# Altium schematic sheet CC2541A.SchDoc: CC2541A
size 431 x 279 mm; Date: Not shown in title block; ApprovedBy: Not shown in title block; CheckedBy: Not shown in title block; Author: Not shown in title block; CompanyName: Not shown in title block; DrawnBy: Ajinder Singh; Engineer: Not shown in title block; Organization: Not shown in title block; Address1: Not shown in title block; Address2: Not shown in title block; Address3: Not shown in title block; Address4: Not shown in title block; DocumentNumber: 1; Revision: Use project parameter SCH_Rev; SheetNumber: 1; SheetTotal: 1; PageSetup: Record=PageOptions|CenterHorizontal=True|CenterVertical=True|PrintScale=0.95|XCorrection=1.00|YCorrection=1.00|PrintKind=0|BorderSize=5000000|LeftOffset=0|BottomOffset=0|Orientation=2|PaperLength=1000|PaperWidth=1000|Scale=100|PaperSource=15|PrintQuality=600|MediaType=1|DitherType=10|PrintScaleMode=1|PaperKind=11x17; CurrentTime: Not shown in title block; CurrentDate: Not shown in title block; Time: Not shown in title block; DocumentFullPathAndName: Not shown in title block; DocumentName: Not shown in title block; ModifiedDate: Not shown in title block; ImagePath: Not shown in title block
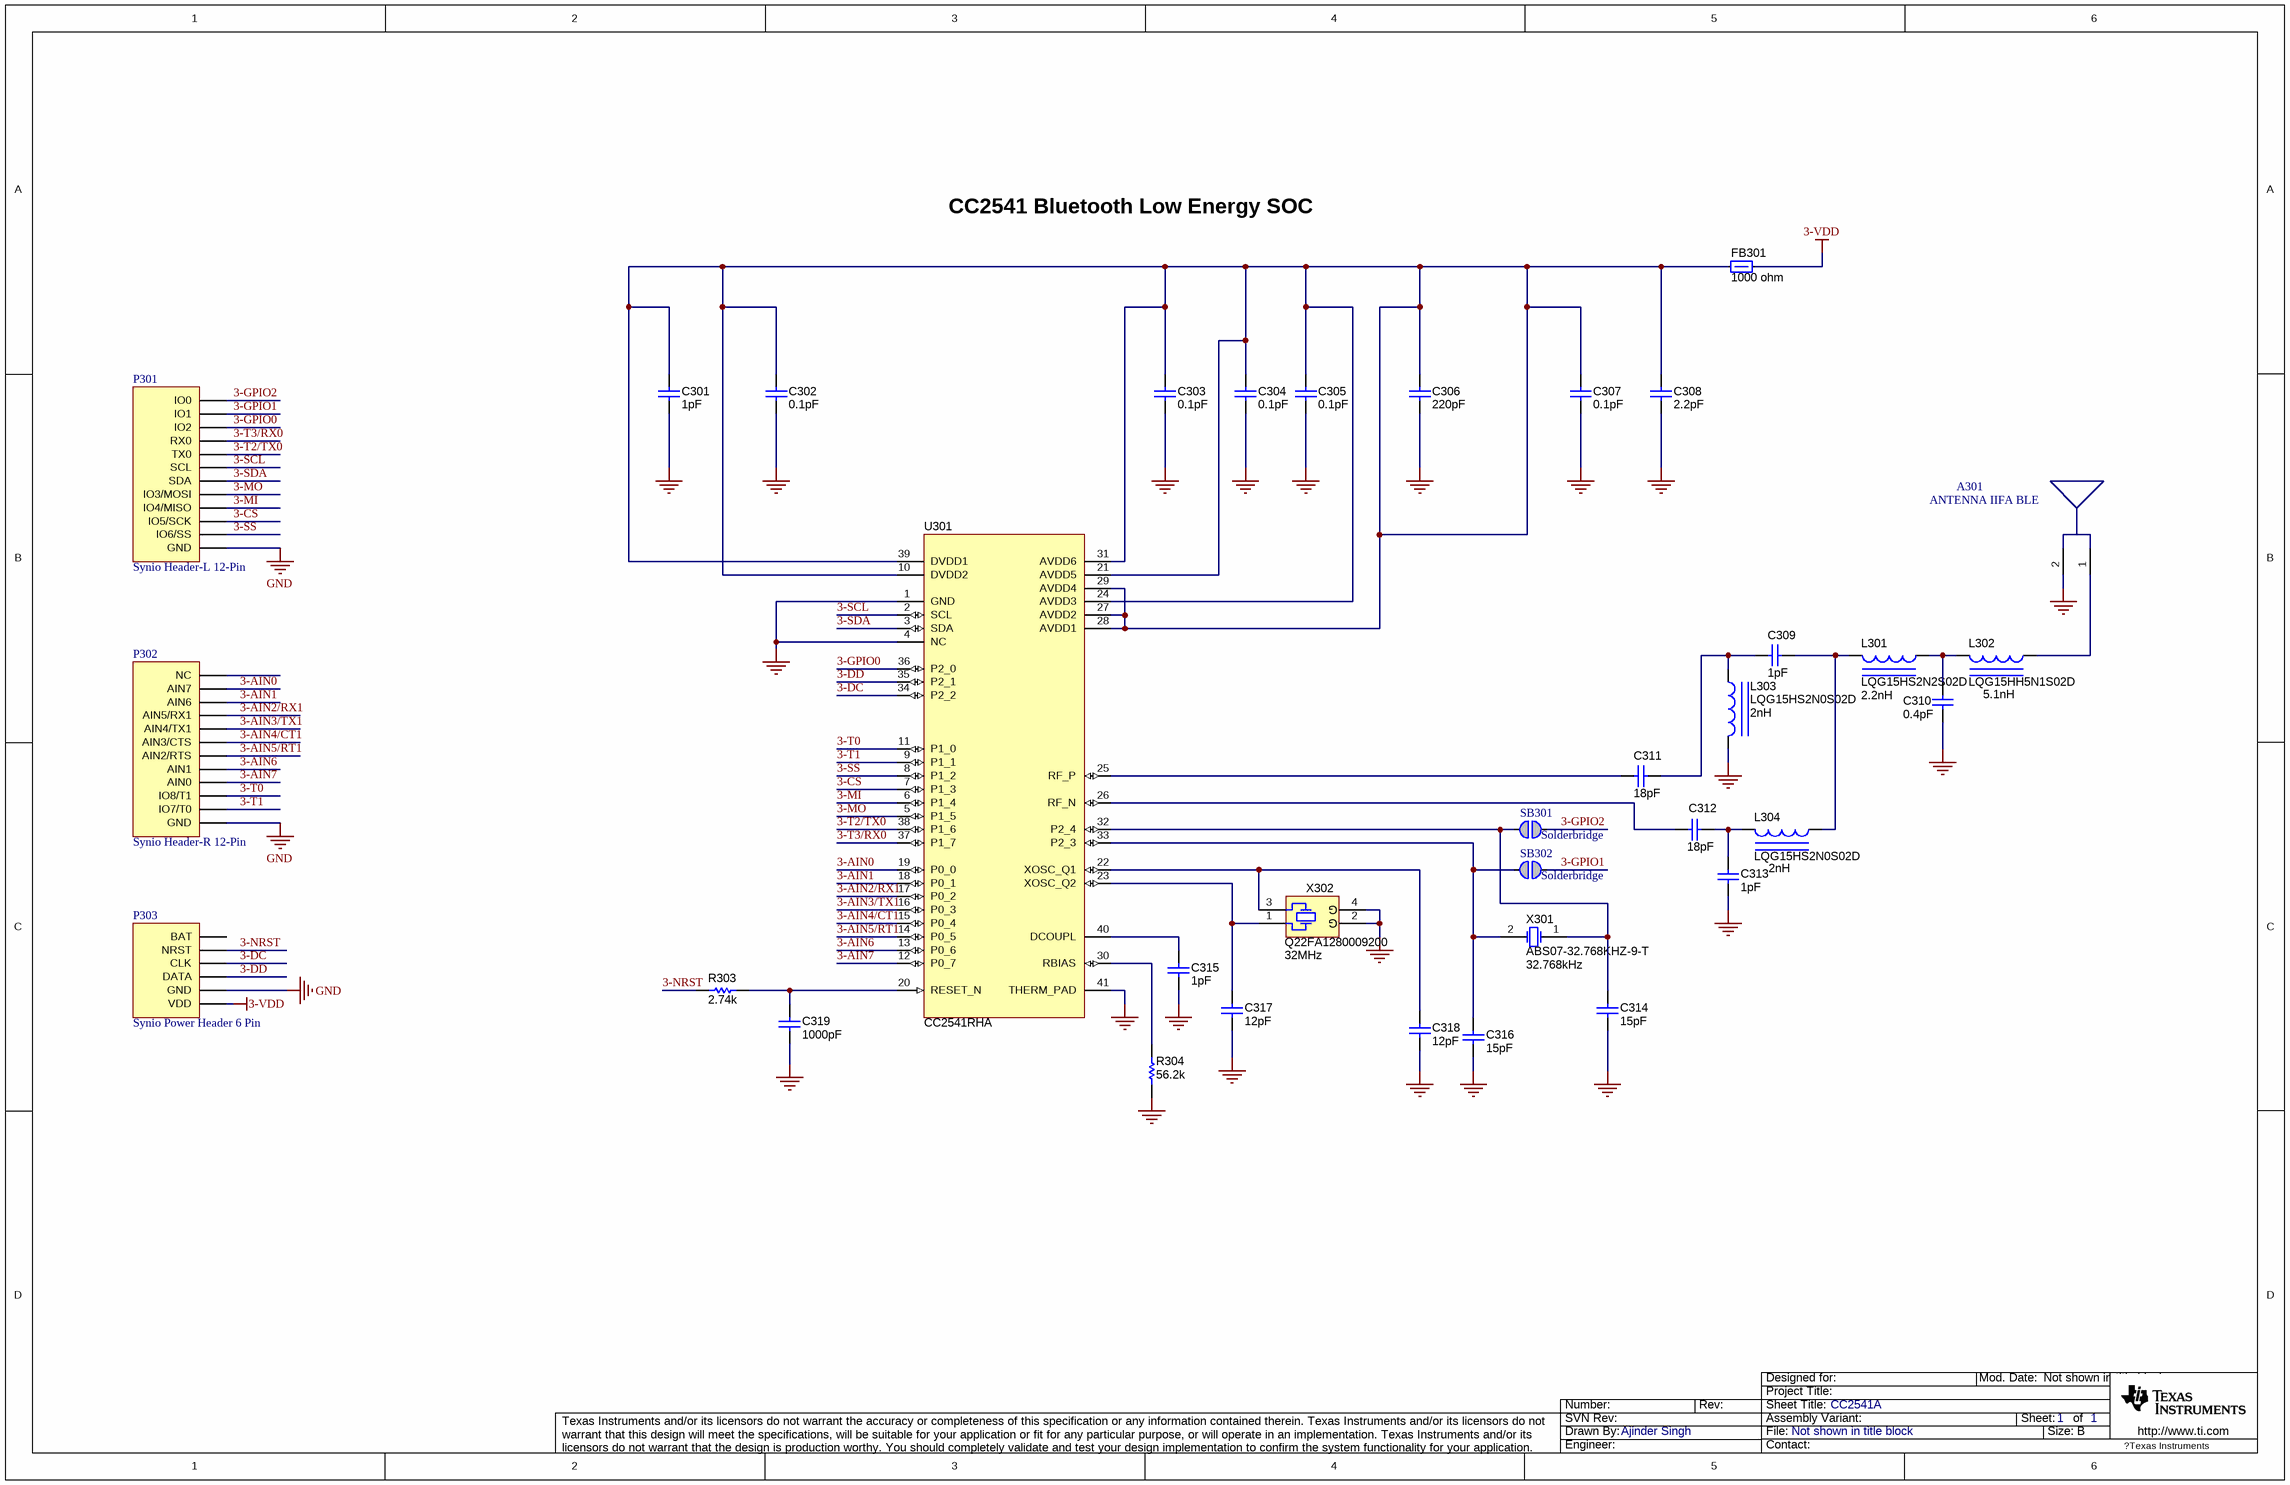
[diagram p0: CC2541A.SchDoc]

## Parts
A301  ANTENNA IIFA BLE  [Antenna_IIFA_BLE-2]  (net tie, no BOM)
C301  ValueDisplayed: 1pF  [0402L]  (hidden comment: C1005X5R0J105M)
C302  ValueDisplayed: 0.1pF  [0402L]  (hidden comment: GRM155R71A104KA01D)
C303  ValueDisplayed: 0.1pF  [0402L]  (hidden comment: GRM155R71A104KA01D)
C304  ValueDisplayed: 0.1pF  [0402L]  (hidden comment: GRM155R71A104KA01D)
C305  ValueDisplayed: 0.1pF  [0402L]  (hidden comment: GRM155R71A104KA01D)
C306  ValueDisplayed: 220pF  [0402L]  (hidden comment: GRM1555C1H221JA01D)
C307  ValueDisplayed: 0.1pF  [0402L]  (hidden comment: GRM155R71A104KA01D)
C308  ValueDisplayed: 2.2pF  [0402L]  (hidden comment: JMK105BJ225MV-F)
C309  ValueDisplayed: 1pF  [0402L]  (hidden comment: GRM1555C1H1R0CA01D)
C310  ValueDisplayed: 0.4pF  [0402L]  (hidden comment: GRM1555C1HR40BA01D)
C311  ValueDisplayed: 18pF  [0402L]  (hidden comment: GRM1555C1H180JA01D)
C312  ValueDisplayed: 18pF  [0402L]  (hidden comment: GRM1555C1H180JA01D)
C313  ValueDisplayed: 1pF  [0402L]  (hidden comment: GRM1555C1H1R0CA01D)
C314  ValueDisplayed: 15pF  [0402L]  (hidden comment: GRM1555C1H150JA01D)
C315  ValueDisplayed: 1pF  [0402L]  (hidden comment: C1005X5R0J105M)
C316  ValueDisplayed: 15pF  [0402L]  (hidden comment: GRM1555C1H150JA01D)
C317  ValueDisplayed: 12pF  [0402L]  (hidden comment: GRM1555C1H120JA01D)
C318  ValueDisplayed: 12pF  [0402L]  (hidden comment: GRM1555C1H120JA01D)
C319  ValueDisplayed: 1000pF  [0402L]  (hidden comment: GRM1555C1H102JA01D)
FB301  value 1000 ohm  [0402]  (hidden comment: BLM15HG102SN1D)
L301  LQG15HS2N2S02D  ValueDisplayed: 2.2nH  [IND_LQG15H]
L302  LQG15HH5N1S02D  ValueDisplayed: 5.1nH  [0402L]
L303  LQG15HS2N0S02D  ValueDisplayed: 2nH  [0402L]
L304  LQG15HS2N0S02D  ValueDisplayed: 2nH  [0402L]
P301  Synio Header-L 12-Pin  [HDR1X12]
P302  Synio Header-R 12-Pin  [HDR1X12]
P303  Synio Power Header 6 Pin  [HDR1X6/2.54MM]
R303  value 2.74k  [0402L]  (hidden comment: CRCW04022K74FKED)
R304  value 56.2k  [0402L]  (hidden comment: CRCW040256K2FKED)
SB301  Solderbridge  [JP2_SMD]  (no BOM)
SB302  Solderbridge  [JP2_SMD]  (no BOM)
U301  CC2541RHA  [RHA0040H]
X301  ABS07-32.768KHZ-9-T  Frequency: 32.768kHz  [XTAL_ABS07]
X302  Q22FA1280009200  Frequency: 32MHz  [XTAL_FA-128]

## Nets
3-VDD: FB301.2 P303.1(VDD)
GND: A301.2 C301.2 C302.2 C303.2 C304.2 C305.2 C306.2 C307.2 C308.2 C310.2 C313.2 C314.2 C315.2 C316.2 C317.2 C318.2 C319.2 L303.2 P301.1(GND) P302.1(GND) P303.2(GND) R304.1 U301.1(GND) U301.4(NC) U301.41(THERM_PAD) X302.2(GND) X302.4(GND)
3-AIN0: P302.11(AIN7) U301.19(P0_0)
3-AIN1: P302.10(AIN6) U301.18(P0_1)
3-AIN2/RX1: P302.9(AIN5/RX1) U301.17(P0_2)
3-AIN3/TX1: P302.8(AIN4/TX1) U301.16(P0_3)
3-AIN4/CT1: P302.7(AIN3/CTS) U301.15(P0_4)
3-AIN5/RT1: P302.6(AIN2/RTS) U301.14(P0_5)
3-AIN6: P302.5(AIN1) U301.13(P0_6)
3-AIN7: P302.4(AIN0) U301.12(P0_7)
3-CS: P301.3(IO5/SCK) U301.7(P1_3)
3-DC: P303.4(CLK) U301.34(P2_2)
3-DD: P303.3(DATA) U301.35(P2_1)
3-GPIO0: P301.10(IO2) U301.36(P2_0)
3-GPIO1: P301.11(IO1) SB302.1
3-GPIO2: P301.12(IO0) SB301.1
3-MI: P301.4(IO4/MISO) U301.6(P1_4)
3-MO: P301.5(IO3/MOSI) U301.5(P1_5)
3-NRST: P303.5(NRST) R303.1
3-SCL: P301.7(SCL) U301.2(SCL)
3-SDA: P301.6(SDA) U301.3(SDA)
3-SS: P301.2(IO6/SS) U301.8(P1_2)
3-T0: P302.3(IO8/T1) U301.11(P1_0)
3-T1: P302.2(IO7/T0) U301.9(P1_1)
3-T2/TX0: P301.8(TX0) U301.38(P1_6)
3-T3/RX0: P301.9(RX0) U301.37(P1_7)
NetA301_1: A301.1 L302.1
NetC301_1: C301.1 C302.1 C303.1 C304.1 C305.1 C306.1 C307.1 C308.1 FB301.1 U301.10(DVDD2) U301.21(AVDD5) U301.24(AVDD3) U301.27(AVDD2) U301.28(AVDD1) U301.29(AVDD4) U301.31(AVDD6) U301.39(DVDD1)
NetC309_1: C309.1 C311.1 L303.1
NetC309_2: C309.2 L301.2 L304.1
NetC310_1: C310.1 L301.1 L302.2
NetC311_2: C311.2 U301.25(RF_P)
NetC312_1: C312.1 C313.1 L304.2
NetC312_2: C312.2 U301.26(RF_N)
NetC314_1: C314.1 SB301.2 U301.32(P2_4) X301.1(OSC1)
NetC315_1: C315.1 U301.40(DCOUPL)
NetC316_1: C316.1 SB302.2 U301.33(P2_3) X301.2(OSC2)
NetC317_1: C317.1 U301.23(XOSC_Q2) X302.1
NetC318_1: C318.1 U301.22(XOSC_Q1) X302.3
NetC319_1: C319.1 R303.2 U301.20(RESET_N)
NetR304_2: R304.2 U301.30(RBIAS)

Not connected (* = marked no-connect by the designer): P302 12(NC); P303 6(BAT)

## Notes on the sheet
- CC2541 Bluetooth Low Energy SOC
- Drawn By:
- SVN Rev:
- Number:
- Rev:
- Sheet Title:
- File:
- Project Title:
- Designed for:
- Assembly Variant:
- Mod. Date:
- Sheet:
- Size:
- of
- B
- http://www.ti.com
- Texas Instruments and/or its licensors do not warrant the accuracy or completeness of this specification or any information contained therein. Texas Instruments and/or its licensors do not warrant that this design will meet the specifications, will be suitable for your application or fit for any particular purpose, or will operate in an implementation. Texas Instruments and/or its licensors do not warrant that the design is production worthy. You should completely validate and test your design implementation to confirm the system functionality for your application.
- Engineer:
- Contact:
- ?Texas Instruments
- (in symbol Q22FA1280009200) G

## Library data of the parts
A301 = Antenna: ASSY_OPTION: NO PART TO ORDER OR PLACE AT ASSY
C301 C315 = C1005X5R0J105M: CAP, CERM, 1uF, 6.3V, +/-20%, X5R, 0402; Manufacturer: TDK; Polarized: N; CompType: Capacitor; U/M: EA; Cap_F: 0.000001; Tolerance_%: 20; ESR_Ohm: 0.0079; Value1: 0.0079 ohm; VDC_V: 6.3; TaMin_C: -55; TaMax_C: 85; Cap_Case: 0402; SymbolVersion: 2008-07-09; Value: 1uF; PartNumber: C1005X5R0J105M; PackageReference: 0402; RoHS: Y; Value2: 6.3V; MountType: SMT; Technology: Ceramic; TempCo: X5R; Published: 2008-06-19; Publisher: Texas Instruments; LatestRevisionDate: 2013-04-08; LatestRevisionNote: Changed publisher; ComponentLink1Description: Datasheet link; ComponentLink1URL: http://www.tdk.co.jp/tefe02/e412_c.pdf; Supplier 1: Digi-Key; Supplier Part Number 1: 445-1415-1-ND; Supplier 2: Farnell; Supplier Part Number 2: 1844107
C302-C305 C307 = GRM155R71A104KA01D: CAP, CERM, 0.1uF, 10V, +/-10%, X7R, 0402; Manufacturer: MuRata; Polarized: N; CompType: Capacitor; U/M: EA; Cap_F: 0.0000001; Tolerance_%: 10; Value1: Unknown; TaMin_C: -55; TaMax_C: 125; Cap_Case: 0402; SymbolVersion: 2008-07-09; Value: 0.1uF; PartNumber: GRM155R71A104KA01D; PackageReference: 0402; RoHS: Y; VDC_V: 10; Value2: 10V; MountType: SMT; Technology: Ceramic; TempCo: X7R; Published: 2008-06-19; Publisher: Texas Instruments; LatestRevisionDate: 2013-04-08; LatestRevisionNote: Changed publisher; ComponentLink1Description: Datasheet link; ComponentLink1URL: http://search.murata.co.jp/Ceramy/PnsearchViewAction.do?HnOFG=ON&HnNFG=ON&SEL_CNT=50&sLang=en&sKey=GRM155R71A104KA01D&x=9&y=9&search=startwith; Supplier 1: Digi-Key; Supplier Part Number 1: GRM155R71A104KA01D-ND; Supplier 2: Mouser; Supplier Part Number 2: 81-GRM155R71A104KA1D; Supplier 3: Farnell; Supplier Part Number 3: 1828860
C306 = GRM1555C1H221JA01D: CAP, CERM, 220pF, 50V, +/-5%, C0G/NP0, 0402; Manufacturer: MuRata; Polarized: N; CompType: Capacitor; U/M: EA; Cap_F: 0.00000000022; Tolerance_%: 5; Value1: Unknown; VDC_V: 50; TaMin_C: -55; TaMax_C: 125; Cap_Case: 0402; SymbolVersion: 2008-07-09; Value: 220pF; PartNumber: GRM1555C1H221JA01D; PackageReference: 0402; RoHS: Y; Value2: 50V; MountType: SMT; Technology: Ceramic; TempCo: C0G/NP0; Published: 2008-06-19; Publisher: Texas Instruments; LatestRevisionDate: 2013-04-08; LatestRevisionNote: Changed publisher; ComponentLink1Description: Datasheet link; ComponentLink1URL: http://search.murata.co.jp/Ceramy/PnsearchViewAction.do?HnOFG=ON&HnNFG=ON&SEL_CNT=50&sLang=en&sKey=GRM1555C1H221JA01D&x=9&y=9&search=startwith; Supplier 1: Digi-Key; Supplier Part Number 1: 490-1293-1-ND; Supplier 2: Mouser; Supplier Part Number 2: 81-GRM1555C1H221JA01; Supplier 3: Farnell; Supplier Part Number 3: 8819580
C308 = JMK105BJ225MV-F: CAP, CERM, 2.2uF, 6.3V, +/-20%, X5R, 0402; Manufacturer: Taiyo Yuden; Polarized: N; CompType: Capacitor; U/M: EA; Cap_F: 0.0000022; Tolerance_%: 20; ESR_Ohm: 0.00152; Value1: 0.00152 ohm; VDC_V: 6.3; TaMin_C: -55; TaMax_C: 125; Cap_Case: 0402; SymbolVersion: 2008-07-09; Value: 2.2uF; PartNumber: JMK105BJ225MV-F; PackageReference: 0402; RoHS: Y; Value2: 6.3V; MountType: SMT; Technology: Ceramic; TempCo: X5R; Published: 2008-06-19; Publisher: Texas Instruments; LatestRevisionDate: 2013-04-08; LatestRevisionNote: Changed publisher; ComponentLink1Description: Datasheet link; ComponentLink1URL: http://www.yuden.co.jp/productdata/catalog/en/mlcc01_e.pdf; Supplier 1: Farnell; Supplier Part Number 1: 1833802
C309 C313 = GRM1555C1H1R0CA01D: CAP, CERM, 1pF, 50V, +/-5%, C0G/NP0, 0402; Manufacturer: MuRata; Polarized: N; CompType: Capacitor; U/M: EA; Cap_F: 0.000000000001; Tolerance_%: 5; Value1: Unknown; VDC_V: 50; TaMin_C: -55; TaMax_C: 125; Cap_Case: 0402; SymbolVersion: 2008-07-09; Value: 1pF; PartNumber: GRM1555C1H1R0CA01D; PackageReference: 0402; RoHS: Y; Value2: 50V; MountType: SMT; Technology: Ceramic; TempCo: C0G/NP0; Published: 2008-06-19; Publisher: Texas Instruments; LatestRevisionDate: 2013-04-08; LatestRevisionNote: Changed publisher; ComponentLink1Description: Datasheet link; ComponentLink1URL: http://search.murata.co.jp/Ceramy/image/img/PDF/ENG/GRM1555C1H1R0CA01.pdf; Supplier 1: Digi-Key; Supplier Part Number 1: 490-3199-1-ND; Supplier 2: Mouser; Supplier Part Number 2: 81-GRM1555C1H1R0CA1D
C310 = GRM1555C1HR40BA01D: CAP, CERM, 0.4pF, 50V, +/-25%, C0G/NP0, 0402; Manufacturer: MuRata; Polarized: N; CompType: Capacitor; U/M: EA; Cap_F: 0.0000000000004; Tolerance_%: 25; Value1: Unknown; VDC_V: 50; TaMin_C: -55; TaMax_C: 125; Cap_Case: 0402; SymbolVersion: 2008-07-09; Value: 0.4pF; PartNumber: GRM1555C1HR40BA01D; PackageReference: 0402; RoHS: Y; Value2: 50V; MountType: SMT; Technology: Ceramic; TempCo: C0G/NP0; Published: 2008-06-19; Publisher: Texas Instruments; LatestRevisionDate: 2013-06-21; ComponentLink1Description: Datasheet link; ComponentLink1URL: http://www.murata.com/products/catalog/pdf/c02e.pdf; Supplier 1: Digi-Key; Supplier Part Number 1: GRM1555C1HR40BA01D-ND; Supplier 2: Mouser; Supplier Part Number 2: 81-GRM1555C1HR40BA1D
C311 C312 = GRM1555C1H180JA01D: CAP, CERM, 18pF, 50V, +/-5%, C0G/NP0, 0402; Manufacturer: MuRata; Polarized: N; CompType: Capacitor; U/M: EA; Cap_F: 0.000000000018; Tolerance_%: 5; Value1: Unknown; VDC_V: 50; TaMin_C: -55; TaMax_C: 125; Cap_Case: 0402; SymbolVersion: 2008-07-09; Value: 18pF; PartNumber: GRM1555C1H180JA01D; PackageReference: 0402; RoHS: Y; Value2: 50V; MountType: SMT; Technology: Ceramic; TempCo: C0G/NP0; Published: 2008-06-19; Publisher: Texas Instruments; LatestRevisionDate: 2013-04-08; LatestRevisionNote: Changed publisher; ComponentLink1Description: Datasheet link; ComponentLink1URL: http://search.murata.co.jp/Ceramy/PnsearchViewAction.do?HnOFG=ON&HnNFG=ON&SEL_CNT=50&sLang=en&sKey=GRM1555C1H180JA01D&x=9&y=9&search=startwith; Supplier 1: Mouser; Supplier Part Number 1: 81-GRM1555C1H180JA1D; Supplier 2: Farnell; Supplier Part Number 2: 1828876; Supplier 3: Newark; Supplier Part Number 3: 14T3293
C314 C316 = GRM1555C1H150JA01D: CAP, CERM, 15pF, 50V, +/-5%, C0G/NP0, 0402; Manufacturer: MuRata; Polarized: N; CompType: Capacitor; U/M: EA; Cap_F: 0.000000000015; Tolerance_%: 5; Value1: Unknown; VDC_V: 50; TaMin_C: -55; TaMax_C: 125; Cap_Case: 0402; SymbolVersion: 2008-07-09; Value: 15pF; PartNumber: GRM1555C1H150JA01D; PackageReference: 0402; RoHS: Y; Value2: 50V; MountType: SMT; Technology: Ceramic; TempCo: C0G/NP0; Published: 2008-06-19; Publisher: Texas Instruments; LatestRevisionDate: 2013-04-08; LatestRevisionNote: Changed publisher; ComponentLink1Description: Datasheet link; ComponentLink1URL: http://search.murata.co.jp/Ceramy/PnsearchViewAction.do?HnOFG=ON&HnNFG=ON&SEL_CNT=50&sLang=en&sKey=GRM1555C1H150JA01D&x=9&y=9&search=startwith; Supplier 1: Mouser; Supplier Part Number 1: 81-GRM1555C1H150JA1D
C317 C318 = GRM1555C1H120JA01D: CAP, CERM, 12pF, 50V, +/-5%, C0G/NP0, 0402; Manufacturer: MuRata; Polarized: N; CompType: Capacitor; U/M: EA; Cap_F: 0.000000000012; Tolerance_%: 5; Value1: Unknown; VDC_V: 50; TaMin_C: -55; TaMax_C: 125; Cap_Case: 0402; SymbolVersion: 2008-07-09; Value: 12pF; PartNumber: GRM1555C1H120JA01D; PackageReference: 0402; RoHS: Y; Value2: 50V; MountType: SMT; Technology: Ceramic; TempCo: C0G/NP0; Published: 2008-06-19; Publisher: Texas Instruments; LatestRevisionDate: 2013-04-08; LatestRevisionNote: Changed publisher; ComponentLink1Description: Datasheet link; ComponentLink1URL: http://search.murata.co.jp/Ceramy/PnsearchViewAction.do?HnOFG=ON&HnNFG=ON&SEL_CNT=50&sLang=en&sKey=GRM1555C1H120JA01D&x=9&y=9&search=startwith; Supplier 1: Mouser; Supplier Part Number 1: 81-GRM1555C1H120JA1D; Supplier 2: Farnell; Supplier Part Number 2: 1828875; Supplier 3: Newark; Supplier Part Number 3: 14T3292
C319 = GRM1555C1H102JA01D: CAP, CERM, 1000pF, 50V, +/-5%, C0G/NP0, 0402; Manufacturer: MuRata; Polarized: N; CompType: Capacitor; U/M: EA; Cap_F: 0.000000001; Tolerance_%: 5; Value1: Unknown; VDC_V: 50; TaMin_C: -55; TaMax_C: 125; Cap_Case: 0402; SymbolVersion: 2008-07-09; Value: 1000pF; PartNumber: GRM1555C1H102JA01D; PackageReference: 0402; RoHS: Y; Value2: 50V; MountType: SMT; Technology: Ceramic; TempCo: C0G/NP0; Published: 2008-06-19; Publisher: Texas Instruments; LatestRevisionDate: 2013-04-08; LatestRevisionNote: Changed publisher; ComponentLink1Description: Datasheet link; ComponentLink1URL: http://search.murata.co.jp/Ceramy/PnsearchViewAction.do?HnOFG=ON&HnNFG=ON&SEL_CNT=50&sLang=en&sKey=GRM1555C1H102JA01D&x=9&y=9&search=startwith; Supplier 1: Digi-Key; Supplier Part Number 1: 490-3244-1-ND; Supplier 2: Mouser; Supplier Part Number 2: 81-GRM1555C1H102JA1D; Supplier 3: Farnell; Supplier Part Number 3: 8819556
FB301 = BLM15HG102SN1D: 0.25A Ferrite Bead, 1000 ohm @ 100MHz, SMD; Manufacturer: MuRata; Imax_A: 0.25; Irms: 0.25A @ C rise; Isat: 0.25A @ % inductance drop; DCR_ohm: 1.1; Value1: 1.1 ohm; ZTyp@100MHz_Ohm: 1000; U/M: EA; CompType: Ferrite Bead; SymbolVersion: 2009-06-02; PartNumber: BLM15HG102SN1D; PackageReference: 0402; Value2: 0.25A; Technology: Multilayer; MountType: SMT; Material: Ferrite; Published: 2008-06-26; Publisher: Texas Instruments; LatestRevisionDate: 2013-06-20; ComponentLink1Description: Datasheet link; ComponentLink1URL: http://search.murata.co.jp/Ceramy/image/img/PDF/ENG/L0110S0101BLM15H.pdf; RoHS: Y; Supplier 1: Digi-Key; Supplier Part Number 1: 490-3999-1-ND; Supplier 2: Mouser; Supplier Part Number 2: 81-BLM15HG102SN1D; Supplier 3: Farnell; Supplier Part Number 3: 1515788
L301 = LQG15HS2N2S02D: Inductor, Multilayer, Air Core, 2.2nH, 0.3A, 0.12 ohm, SMD; Manufacturer: MuRata; Ind_H: 2.2E-9; Imax_A: 0.3; Irms: 0.3A @ C rise; Isat: 0.3A @ % inductance drop; DCR_ohm: 0.12; U/M: EA; SymbolVersion: 2008-07-23; CompType: Inductor; Value: 2.2nH; PartNumber: LQG15HS2N2S02D; PackageReference: 0402 polarized; Value1: 0.12 ohm; Value2: 0.3A; Technology: Multilayer; MountType: SMT; Material: Air Core; Published: 2008-06-26; Publisher: Texas Instruments; LatestRevisionDate: 2013-06-24; ComponentLink1Description: Datasheet link; ComponentLink1URL: http://search.murata.co.jp/Ceramy/image/img/PDF/ENG/L0075S0083LQG15HS.pdf; RoHS: Y; Supplier 1: Digi-Key; Supplier Part Number 1: 490-2614-1-ND; Supplier 2: Mouser; Supplier Part Number 2: 81-LQG15HS2N2S02D
L302 = LQG15HH5N1S02D: Inductor, Multilayer, Ferrite, 5.1nH, 0.3A, 0.2 ohm, SMD; Manufacturer: MuRata; Ind_H: 5.1E-9; Imax_A: 0.3; Irms: 0.3A @ C rise; DCR_ohm: 0.2; Value1: 0.2 ohm; U/M: EA; SymbolVersion: 2008-07-23; CompType: Inductor; Value: 5.1nH; PartNumber: LQG15HH5N1S02D; PackageReference: 0402; Value2: 0.3A; Technology: Multilayer; MountType: SMT; Material: Ferrite; Published: 2008-06-26; Publisher: Texas Instruments; LatestRevisionDate: 2013-06-20; ComponentLink1Description: Datasheet link; ComponentLink1URL: http://www.murata.com/products/catalog/pdf/o05e.pdf; RoHS: Y; Supplier 1: Mouser; Supplier Part Number 1: 81-LQG15HH5N1S02D
L303 L304 = LQG15HS2N0S02D: Inductor, Multilayer, Ferrite, 2nH, 0.3A, 0.1 ohm, SMD; Manufacturer: MuRata; Ind_H: 2.0E-9; Imax_A: 0.3; Irms: 0.3A @ C rise; Isat: 0.3A @ % inductance drop; DCR_ohm: 0.1; Value1: 0.1 ohm; U/M: EA; SymbolVersion: 2008-07-23; CompType: Inductor; Value: 2nH; PartNumber: LQG15HS2N0S02D; PackageReference: 0402; Value2: 0.3A; Technology: Multilayer; MountType: SMT; Material: Ferrite; Published: 2008-06-26; Publisher: Texas Instruments; LatestRevisionDate: 2013-06-20; ComponentLink1Description: Datasheet link; ComponentLink1URL: http://search.murata.co.jp/Ceramy/image/img/PDF/ENG/L0075S0083LQG15HS.pdf; RoHS: Y; Supplier 1: Digi-Key; Supplier Part Number 1: 490-6569-1-ND; Supplier 2: Mouser; Supplier Part Number 2: 81-LQG15HS2N0S02D
P301 = Synio Header-L 12-Pin: Synio Header-L, 12-Pin; LatestRevisionDate: 17-Jul-2002; LatestRevisionNote: Re-released for DXP Platform.; Publisher: Altium Limited
P302 = Synio Header-R 12-Pin: Synio Header-R, 12-Pin; LatestRevisionDate: 17-Jul-2002; LatestRevisionNote: Re-released for DXP Platform.; Publisher: Altium Limited
R303 = CRCW04022K74FKED: RES, 2.74k ohm, 1%, 0.063W, 0402; Manufacturer: Vishay-Dale; CompType: Resistor; Res_ohm: 2740; Value_Code: 2k74; Tolerance_%: 1; Power_W: 0.063; VDC_V: 50; TempCo: 100 ppm/C; EIA_Code: E96; U/M: EA; SymbolVersion: 2009-05-29; PartNumber: CRCW04022K74FKED; PackageReference: 0402; RoHS: Y; Value1: 1%; Value2: 0.063W; MountType: SMT; Technology: Thick Film; Published: 2008-06-26; Publisher: Texas Instruments; LatestRevisionDate: 2013-01-08; ComponentLink1Description: Datasheet link; ComponentLink1URL: http://www.vishay.com/docs/20035/dcrcwe3.pdf; Supplier 1: Digi-Key; Supplier Part Number 1: 541-2.74KLCT-ND; Supplier 2: Mouser; Supplier Part Number 2: 71-CRCW0402-2.74K-E3; Supplier 3: Farnell; Supplier Part Number 3: 1469692
R304 = CRCW040256K2FKED: RES, 56.2k ohm, 1%, 0.063W, 0402; Manufacturer: Vishay-Dale; CompType: Resistor; Res_ohm: 56200; Value_Code: 56k2; Tolerance_%: 1; Power_W: 0.063; VDC_V: 50; TempCo: 100 ppm/C; EIA_Code: E96; U/M: EA; SymbolVersion: 2009-05-29; PartNumber: CRCW040256K2FKED; PackageReference: 0402; RoHS: Y; Value1: 1%; Value2: 0.063W; MountType: SMT; Technology: Thick Film; Published: 2008-06-26; Publisher: Texas Instruments; LatestRevisionDate: 2013-01-08; ComponentLink1Description: Datasheet link; ComponentLink1URL: http://www.vishay.com/docs/20035/dcrcwe3.pdf; Supplier 1: Digi-Key; Supplier Part Number 1: 541-56.2KLCT-ND; Supplier 2: Mouser; Supplier Part Number 2: 71-CRCW0402-56.2K-E3; Supplier 3: Farnell; Supplier Part Number 3: 1652808
SB301 SB302 = Solderbridge: Artikkelnr Noca: N.A.; Part Number: Solderbridge; Manufacturer: *; Manufacturer Part Number: *; Datasheet: *; Footprint: Solderbridge; LatestRevisionDate: 2009-12-14; Pin Count: 2; Publisher: Nordic Semiconductor; Published: 2009-12-14; Value: Solderbridge; Note: *; Supplier: *; Supplier part number: *; 2nd source Supplier: *; 2nd source part number: *
U301 = CC2541RHA: 2.4-GHz Bluetooth low energy and Proprietary System-on-Chip, RHA0040H; Alternate Manufacturer: None; Manufacturer: Texas Instruments; SymbolCreator: a0411947; CompType: IC; U/M: EA; SymbolVersion: 2013-06-17; PartNumber: CC2541RHA; PackageReference: RHA0040H; MountType: SMT; ComponentLink1Description: Datasheet Link; ComponentLink1URL: http://www.ti.com/lit/ds/symlink/cc2541.pdf; RoHS: Y; Publisher: Texas Instruments; LatestRevisionDate: 2013-06-21; LatestRevisionNote: Added Parts
X301 = ABS07-32.768KHZ-9-T: CRYSTAL, 32.768KHZ, 9PF, SMD; Manufacturer: Abracon Corportation; SymbolCreator: a0412235; U/M: EA; TaMin_C: -40; TaMax_C: 85; Frequency Stability: ?0ppm; SymbolVersion: 2008-07-09; PartNumber: ABS07-32.768KHZ-9-T; CompType: Crystal; PackageReference: 3.2x0.9x1.5mm; MountType: SMT; RoHS: Y; ComponentLink1Description: Datasheet Link; ComponentLink1URL: http://www.abracon.com/Resonators/ABS07.pdf; Publisher: Texas Instruments; LatestRevisionDate: 2013-06-21; LatestRevisionNote: Changed publisher; Supplier 1: Digi-Key; Supplier Part Number 1: 535-9544-1-ND; Supplier 2: Mouser; Supplier Part Number 2: 815-ABS07-32.768K9T; Supplier 3: Farnell; Supplier Part Number 3: 2101346
X302 = Q22FA1280009200: Crystal, 32MHz, 10pF, SMD; Manufacturer: Epson; SymbolCreator: a0412235; U/M: EA; TaMin_C: -40; TaMax_C: 85; Frequency Stability: ?0ppm; SymbolVersion: 2011-08-23; PartNumber: Q22FA1280009200; CompType: Crystal; PackageReference: Crystal, 2.6x0.5x1.6mm; MountType: SMT; RoHS: Y; ComponentLink1Description: Datasheet Link; ComponentLink1URL: http://www.epsondevice.com/docs/qd/en/DownloadServlet?id=ID000449; Publisher: Texas Instruments; LatestRevisionDate: 2013-06-21; LatestRevisionNote: Changed publisher